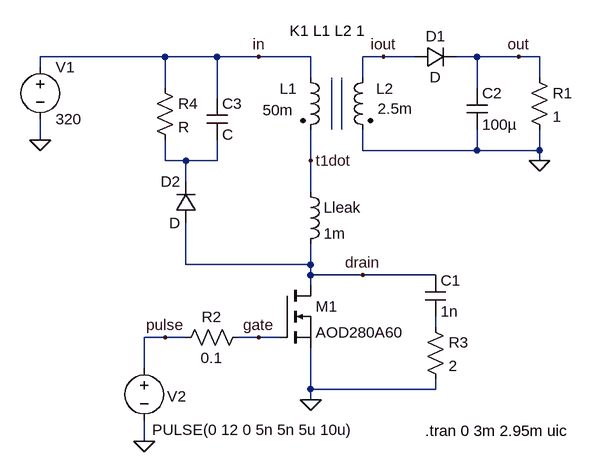
[diagram p0: schematic 03-flyback_transformer_ringing_schematic.asc]
03-flyback_transformer_ringing_schematic.asc, the LTspice schematic file:
Version 4
SHEET 1 880 680
WIRE -64 -112 -256 -112
WIRE 16 -112 -64 -112
WIRE 80 -112 16 -112
WIRE 160 -112 80 -112
WIRE 272 -112 240 -112
WIRE 320 -112 272 -112
WIRE 416 -112 384 -112
WIRE 480 -112 416 -112
WIRE 512 -112 480 -112
WIRE -256 -96 -256 -112
WIRE 160 -80 160 -112
WIRE 240 -80 240 -112
WIRE 512 -80 512 -112
WIRE -64 -64 -64 -112
WIRE 416 -64 416 -112
WIRE 16 -48 16 -112
WIRE -256 16 -256 -16
WIRE 240 32 240 0
WIRE 416 32 416 0
WIRE 416 32 240 32
WIRE 512 32 512 0
WIRE 512 32 416 32
WIRE -64 48 -64 16
WIRE -32 48 -64 48
WIRE 16 48 16 16
WIRE 16 48 -32 48
WIRE 160 48 160 0
WIRE 512 48 512 32
WIRE -32 80 -32 48
WIRE 160 96 160 48
WIRE -32 208 -32 144
WIRE 160 208 160 176
WIRE 160 208 -32 208
WIRE 160 224 160 208
WIRE 240 224 160 224
WIRE 352 224 240 224
WIRE 160 240 160 224
WIRE 352 304 352 288
WIRE -64 320 -96 320
WIRE -32 320 -64 320
WIRE 80 320 48 320
WIRE 112 320 80 320
WIRE -96 368 -96 320
WIRE 160 400 160 336
WIRE 352 400 352 384
WIRE 352 400 160 400
WIRE 160 416 160 400
WIRE -96 480 -96 448
FLAG 160 416 0
FLAG -256 16 0
FLAG -96 480 0
FLAG 480 -112 out
FLAG 80 -112 in
FLAG 240 224 drain
FLAG 160 48 t1dot
FLAG 272 -112 iout
FLAG -64 320 pulse
FLAG 80 320 gate
FLAG 512 48 0
SYMBOL ind 144 80 R0
SYMATTR InstName Lleak
SYMATTR Value 1m
SYMATTR SpiceLine Rser=100m
SYMBOL nmos 112 240 R0
SYMATTR InstName M1
SYMATTR Value AOD280A60
SYMBOL ind2 144 -96 R0
WINDOW 0 -32 33 Left 2
WINDOW 3 -58 66 Left 2
SYMATTR InstName L1
SYMATTR Value 50m
SYMATTR Type ind
SYMATTR SpiceLine Rser=1
SYMBOL ind2 256 -96 M0
WINDOW 0 -32 33 Left 2
WINDOW 3 -61 64 Left 2
SYMATTR InstName L2
SYMATTR Value 2.5m
SYMATTR Type ind
SYMBOL res 496 -96 R0
SYMATTR InstName R1
SYMATTR Value 1
SYMBOL diode 320 -96 R270
WINDOW 0 32 32 VTop 2
WINDOW 3 0 32 VBottom 2
SYMATTR InstName D1
SYMBOL cap 400 -64 R0
SYMATTR InstName C2
SYMATTR Value 100µ
SYMBOL voltage -256 -112 R0
WINDOW 123 0 0 Left 0
WINDOW 39 0 0 Left 0
SYMATTR InstName V1
SYMATTR Value 320
SYMBOL res 64 304 R90
WINDOW 0 0 56 VBottom 2
WINDOW 3 32 56 VTop 2
SYMATTR InstName R2
SYMATTR Value 0.1
SYMBOL voltage -96 352 R0
WINDOW 0 35 59 Left 2
WINDOW 3 12 110 Left 2
WINDOW 123 0 0 Left 0
WINDOW 39 0 0 Left 0
SYMATTR InstName V2
SYMATTR Value PULSE(0 12 0 5n 5n 5u 10u)
SYMBOL cap 336 224 R0
SYMATTR InstName C1
SYMATTR Value 1n
SYMBOL res 336 288 R0
SYMATTR InstName R3
SYMATTR Value 2
SYMBOL res -80 -80 R0
SYMATTR InstName R4
SYMBOL cap 0 -48 R0
SYMATTR InstName C3
SYMBOL diode -16 144 R180
WINDOW 0 24 64 Left 2
WINDOW 3 24 0 Left 2
SYMATTR InstName D2
TEXT 128 -152 Left 2 !K1 L1 L2 1
TEXT 336 464 Left 2 !.tran 0 3m 2.95m uic
LINE Normal 192 0 192 -80
LINE Normal 208 0 208 -80

The netlist it stands for:
* 03-flyback_transformer_ringing_schematic.asc
Lleak t1dot drain 1m Rser=100m
M1 drain gate 0 0 AOD280A60
L1 in t1dot 50m Rser=1
L2 iout 0 2.5m
R1 out 0 1
D1 iout out D
C2 out 0 100µ
V1 in 0 320
R2 gate pulse 0.1
V2 pulse 0 PULSE(0 12 0 5n 5n 5u 10u)
C1 drain N002 1n
R3 N002 0 2
R4 in N001 R
C3 in N001 C
D2 drain N001 D
.model D D
.lib standard.dio
.model NMOS NMOS
.model PMOS PMOS
.lib standard.mos
K1 L1 L2 1
.tran 0 3m 2.95m uic
.backanno
.end